# Altium schematic sheet FinalSubNode.SchDoc
size A
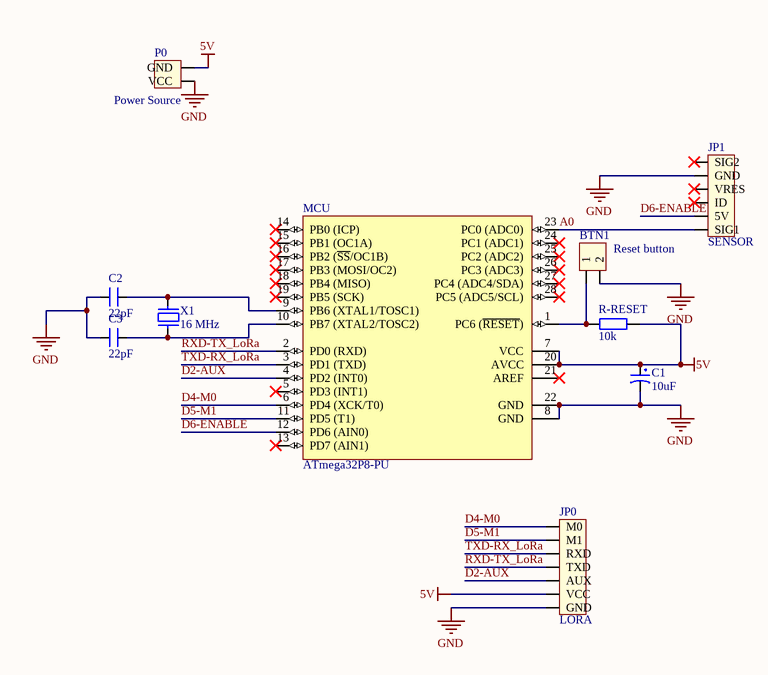
[diagram p0: FinalSubNode.SchDoc]

## Parts
BTN1  Reset button  [HED2]
C1  10uF  [CP1/2]
C2  22pF  [CN1]
C3  22pF  [CN1]
JP0  LORA  [CON7]
JP1  SENSOR  [CON6]
MCU  ATmega32P8-PU  [DIP28/W0.3]
P0  Power Source  [HED2]
R-RESET  10k  [R1/4W]
X1  16 MHz  [XT2]

## Nets
5V: C1.1 JP0.6(VCC) MCU.7(VCC) MCU.20(AVCC) P0.2(GND) R-RESET.2
GND: BTN1.2 C1.2 C2.1 C3.1 JP0.7(GND) JP1.2(GND) MCU.8(GND) MCU.22(GND) P0.1(VCC)
A0: JP1.6(SIG1) MCU.23(PC0_(ADC0))
D2-AUX: JP0.5(AUX) MCU.4(PD2_(INT0))
D4-M0: JP0.1(M0) MCU.6(PD4_(XCK/T0))
D5-M1: JP0.2(M1) MCU.11(PD5_(T1))
D6-ENABLE: JP1.5(5V) MCU.12(PD6_(AIN0))
RXD-TX_LoRa: JP0.4(TXD) MCU.2(PD0_(RXD))
TXD-RX_LoRa: JP0.3(RXD) MCU.3(PD1_(TXD))
NetBTN1_1: BTN1.1 MCU.1(PC6_(~{RESET})) R-RESET.1
NetC2_2: C2.2 MCU.9(PB6_(XTAL1/TOSC1)) X1.2
NetC3_2: C3.2 MCU.10(PB7_(XTAL2/TOSC2)) X1.1

Not connected (* = marked no-connect by the designer): JP1 1(SIG2)* 3(VRES)* 4(ID)*; MCU 5(PD3_(INT1))* 13(PD7_(AIN1))* 14(PB0_(ICP))* 15(PB1_(OC1A))* 16(PB2_(~{SS}/OC1B))* 17(PB3_(MOSI/OC2))* 18(PB4_(MISO))* 19(PB5_(SCK))* 21(AREF)* 24(PC1_(ADC1))* 25(PC2_(ADC2))* 26(PC3_(ADC3))* 27(PC4_(ADC4/SDA))* 28(PC5_(ADC5/SCL))*

## Library data of the parts
BTN1 P0 = Hed2: Header 2 (Green); Value: Header 2
C1 = CP1: Cap P  0,1uF < 22uF , 16 - 50V; Value: 10uF/50V; Description 1: 10 => 220uF/6,3V/10V - 10uF => 100uF/16V; Description 2: 0,1uF => 33uF/50V - 10uF => 22uF/63V; Description 3: 0,47uF => 10uF/100V
C2 C3 = CN1: Cap np  1pF - 472pF; Value: 100pF
JP0 = Con7: Connector 7; Value: Connector 7
JP1 = Con6: Connector 6; Value: Connector 6
MCU = ATmega8-L: 8-Bit AVR Microcontroller with 8K Bytes of In-System Programmable Flash Memory; Value: ATmega8-L
R-RESET = R1/4W: Resistor 1/4W; Value: R1/4W - 1K
X1 = XT2: Crystal For all Crystal 2pin.; Value: 4Mhz